# Altium schematic sheet CVx1.SchDoc
size A4
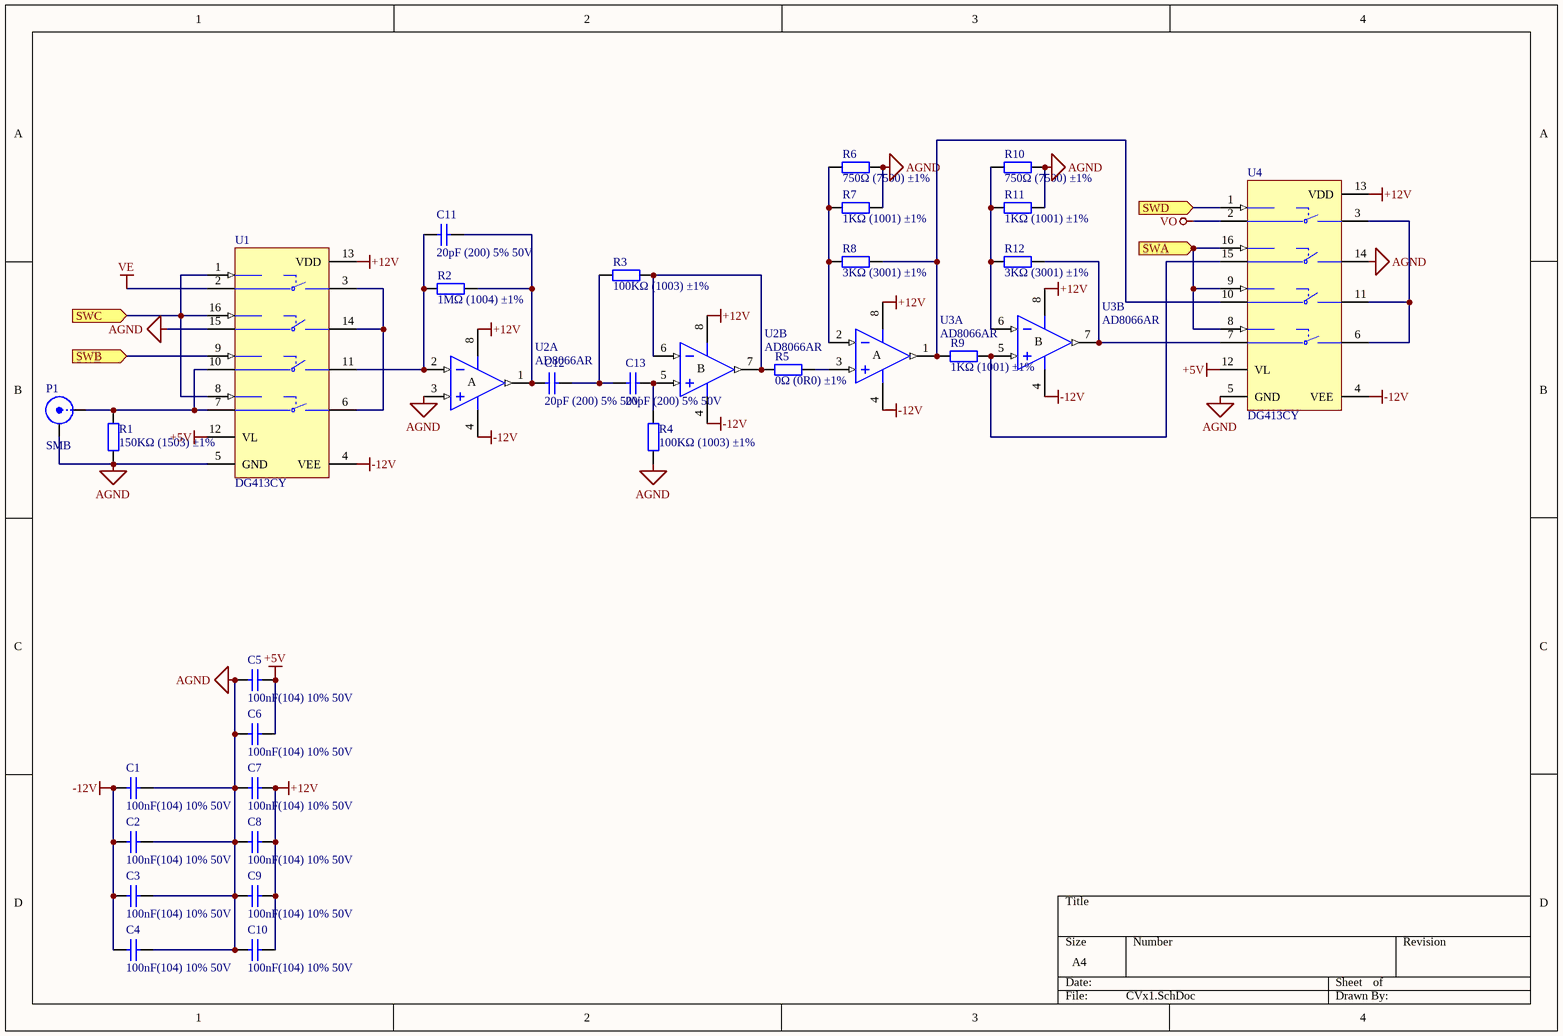
[diagram p0: CVx1.SchDoc]

## Parts
C1  100nF(104) 10% 50V  [LC-0805_C]
C2  100nF(104) 10% 50V  [LC-0805_C]
C3  100nF(104) 10% 50V  [LC-0805_C]
C4  100nF(104) 10% 50V  [LC-0805_C]
C5  100nF(104) 10% 50V  [LC-0805_C]
C6  100nF(104) 10% 50V  [LC-0805_C]
C7  100nF(104) 10% 50V  [LC-0805_C]
C8  100nF(104) 10% 50V  [LC-0805_C]
C9  100nF(104) 10% 50V  [LC-0805_C]
C10  100nF(104) 10% 50V  [LC-0805_C]
C11  20pF (200) 5% 50V  [LC-0805_C]
C12  20pF (200) 5% 50V  [LC-0805_C]
C13  20pF (200) 5% 50V  [LC-0805_C]
P1  SMB  [SMB_V-RJ45]
R1  150KΩ (1503) ±1%  [LC-0805_R]
R2  1MΩ (1004) ±1%  [LC-0805_R]
R3  100KΩ (1003) ±1%  [LC-0805_R]
R4  100KΩ (1003) ±1%  [LC-0805_R]
R5  0Ω (0R0) ±1%  [LC-0805_R]
R6  750Ω (7500) ±1%  [LC-0805_R]
R7  1KΩ (1001) ±1%  [LC-0805_R]
R8  3KΩ (3001) ±1%  [LC-0805_R]
R9  1KΩ (1001) ±1%  [LC-0805_R]
R10  750Ω (7500) ±1%  [LC-0805_R]
R11  1KΩ (1001) ±1%  [LC-0805_R]
R12  3KΩ (3001) ±1%  [LC-0805_R]
U1  DG413CY  [NSO16_N]
U2  AD8066AR  [SO-8_N]  (parts A,B of 2)
U3  AD8066AR  [SO-8_N]  (parts A,B of 2)
U4  DG413CY  [NSO16_N]

## Ports
SWA (in), SWB (in), SWC (in), SWD (in)

## Nets
+5V: C5.2 C6.2 U1.12(VL) U4.12(VL)
+12V: C7.2 C8.2 C9.2 C10.2 U1.13(VDD) U2.8(V+) U3.8(V+) U4.13(VDD)
-12V: C1.1 C2.1 C3.1 C4.1 U1.4(VEE) U2.4(V-) U3.4(V-) U4.4(VEE)
AGND: C1.2 C2.2 C3.2 C4.2 C5.1 C6.1 C7.1 C8.1 C9.1 C10.1 P1.2(Y) R1.2 R4.1 R6.2 R7.2 R10.2 R11.2 U1.5(GND) U1.15(D2) U2.3(IN+) U4.5(GND) U4.14(S2)
VE: U1.2(D1)
VO: U4.2(D1)
SWA: U4.8(IN_4) U4.9(IN3) U4.16(IN2) ; port SWA
SWB: U1.9(IN3) ; port SWB
SWC: U1.1(IN1) U1.8(IN_4) U1.16(IN2) ; port SWC
SWD: U4.1(IN1) ; port SWD
NetC11_1: C11.1 R2.2 U1.11(S3) U2.2(IN-)
NetC11_2: C11.2 C12.1 R2.1 U2.1(OUT)
NetC12_2: C12.2 C13.1 R3.2
NetC13_2: C13.2 R4.2 U2.5(IN+)
NetP1_1: P1.1(X) R1.1 U1.7(D4) U1.10(D3)
NetR3_1: R3.1 R5.1 U2.6(IN-) U2.7(OUT)
NetR5_2: R5.2 U3.3(IN+)
NetR6_1: R6.1 R7.1 R8.1 U3.2(IN-)
NetR8_2: R8.2 R9.1 U3.1(OUT) U4.10(D3)
NetR9_2: R9.2 U3.5(IN+) U4.15(D2)
NetR10_1: R10.1 R11.1 R12.1 U3.6(IN-)
NetR12_2: R12.2 U3.7(OUT) U4.7(D4)
NetU1_3: U1.3(S1) U1.6(S4) U1.14(S2)
NetU4_3: U4.3(S1) U4.6(S4) U4.11(S3)

## Notes on the sheet
- (in symbol AD8056AR, part A) A
- (in symbol AD8056AR, part B) B

## Library data of the parts
C1-C10 = 0805 100nF(104) 10% 50V: 贴片电容; ComponentLink1Description: 供应商链接; ComponentLink1URL: http://www.szlcsc.com/product/details_50686.html; Package: 0805; Supplier: LC; SuppliersPartNumber: C49678
C11-C13 = 0805 20pF (200) 5% 50V: 贴片电容; ComponentLink1Description: 供应商链接; ComponentLink1URL: http://www.szlcsc.com/product/details_2150.html; Package: 0805; Supplier: LC; SuppliersPartNumber: C1798
P1 = SMB: SMB Straight Connector; LatestRevisionDate: 17-Jul-2002; LatestRevisionNote: Re-released for DXP Platform.; Publisher: Altium Limited
R1 = 0805 150KΩ (1503) 1%: 贴片电阻; ComponentLink1Description: 供应商链接; ComponentLink1URL: http://www.szlcsc.com/product/details_18158.html; Package: 0805; Supplier: LC; SuppliersPartNumber: C17470
R2 = 0805 1MΩ (1004) 1%: 贴片电阻; ComponentLink1Description: 供应商链接; ComponentLink1URL: http://www.szlcsc.com/product/details_18202.html; Package: 0805; Supplier: LC; SuppliersPartNumber: C17514
R3 R4 = 0805 100KΩ (1003) 1%: 贴片电阻; ComponentLink1Description: 供应商链接; ComponentLink1URL: http://www.szlcsc.com/product/details_18095.html; Package: 0805; Supplier: LC; SuppliersPartNumber: C17407
R5 = 0805 0Ω (0R0) 1%: 贴片电阻; ComponentLink1Description: 供应商链接; ComponentLink1URL: http://www.szlcsc.com/product/details_18165.html; Package: 0805; Supplier: LC; SuppliersPartNumber: C17477
R6 R10 = 0805 750Ω (7500) 1%: 贴片电阻; ComponentLink1Description: 供应商链接; ComponentLink1URL: http://www.szlcsc.com/product/details_18506.html; Package: 0805; Supplier: LC; SuppliersPartNumber: C17818
R7 R9 R11 = 0805 1KΩ (1001) 1%: 贴片电阻; ComponentLink1Description: 供应商链接; ComponentLink1URL: http://www.szlcsc.com/product/details_18201.html; Package: 0805; Supplier: LC; SuppliersPartNumber: C17513
R8 R12 = 0805 3KΩ (3001) 1%: 贴片电阻; ComponentLink1Description: 供应商链接; ComponentLink1URL: http://www.szlcsc.com/product/details_18349.html; Package: 0805; Supplier: LC; SuppliersPartNumber: C17661
U1 U4 = DG413CY: Improved, Quad, SPST Analog Switches; Published: 16-Jan-2001; LatestRevisionDate: 13-Apr-2006; LatestRevisionNote: IPC-7351 Footprint Added.; DatasheetVersion: Aug-1995; PackageReference: NSO16; Publisher: Altium Limited; PackageDescription: 16-Pin Small Outline Integrated Circuit 1.27 mm Pitch; Code_JEDEC: MS-012-AC; Code_IPC: SOIC127P600-16; ComponentLink1Description: Manufacturer Link; ComponentLink1URL: http://www.maxim-ic.com/; ComponentLink2Description: Datasheet; ComponentLink2URL: http://pdfserv.maxim-ic.com/en/ds/DG411-DG413.pdf
U2 U3 = AD8056AR: Low Cost, 300MHz Voltage Feedback Amplifier; Published: 8-Jun-2000; LatestRevisionDate: 13-Apr-2006; LatestRevisionNote: IPC-7351 Footprint Added.; DatasheetVersion: REV. 0 1997; PackageVersion: revA; PackageReference: SO-8; Publisher: Altium Limited; PackageDescription: 8-Pin Small Outline Integrated Circuit 1.27 mm Pitch; Code_JEDEC: MS-012-AA; Code_IPC: SOIC127P600-8; ComponentLink1Description: Manufacturer Link; ComponentLink1URL: http://www.analog.com/en/prod/0,,759_786_AD8055%2C00.html; ComponentLink2Description: Datasheet; ComponentLink2URL: http://www.analog.com/UploadedFiles/Data_Sheets/40402558757264AD8055_6_i.pdf